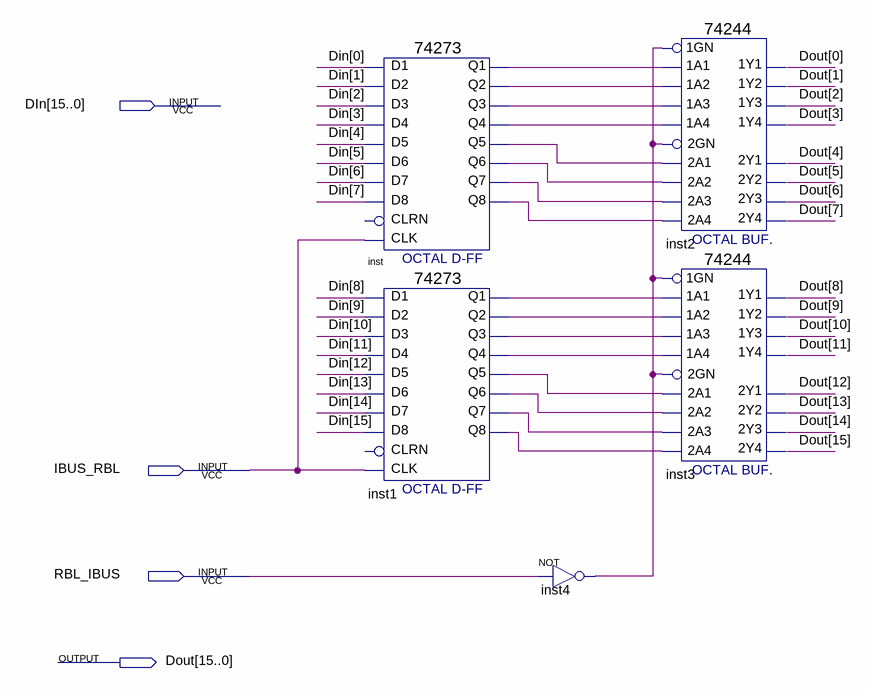
[diagram p0: schematic sheet]
// Quartus schematic RBL.bdf as structural Verilog: 5 symbols, 4 pins
module RBL (
  input  [15:0] DIn,
  input  IBUS_RBL,
  input  RBL_IBUS,
  output [15:0] Dout
);

  wire inst1_q1, inst1_q2, inst1_q3, inst1_q4, inst1_q5, inst1_q6, inst1_q7, inst1_q8, inst4_out, inst_q1,
       inst_q2, inst_q3, inst_q4, inst_q5, inst_q6, inst_q7, inst_q8;

  \74273  inst (
    .D2(DIn[1]), .D3(DIn[2]), .D1(DIn[0]), .D4(DIn[3]), .D7(DIn[6]), .D6(DIn[5]), .D5(DIn[4]), .D8(DIn[7]),
    .CLK(IBUS_RBL), .Q4(inst_q4), .Q1(inst_q1), .Q2(inst_q2), .Q3(inst_q3), .Q6(inst_q6), .Q5(inst_q5),
    .Q7(inst_q7), .Q8(inst_q8));  // open: CLRN
  \74273  inst1 (
    .D2(DIn[9]), .D3(DIn[10]), .D1(DIn[8]), .D4(DIn[11]), .D7(DIn[14]), .D6(DIn[13]), .D5(DIn[12]),
    .D8(DIn[15]), .CLK(IBUS_RBL), .Q4(inst1_q4), .Q1(inst1_q1), .Q2(inst1_q2), .Q3(inst1_q3), .Q6(inst1_q6),
    .Q5(inst1_q5), .Q7(inst1_q7), .Q8(inst1_q8));  // open: CLRN
  not inst4 (inst4_out, RBL_IBUS);
  \74244  inst2 (
    .\1A2 (inst_q2), .\1A4 (inst_q4), .\1A1 (inst_q1), .\1A3 (inst_q3), .\1GN (inst4_out), .\2A3 (inst_q7),
    .\2GN (inst4_out), .\2A1 (inst_q5), .\2A4 (inst_q8), .\2A2 (inst_q6), .\1Y2 (Dout[1]), .\1Y4 (Dout[3]),
    .\2Y1 (Dout[4]), .\1Y1 (Dout[0]), .\2Y3 (Dout[6]), .\2Y4 (Dout[7]), .\1Y3 (Dout[2]), .\2Y2 (Dout[5]));
  \74244  inst3 (
    .\1A2 (inst1_q2), .\1A4 (inst1_q4), .\1A1 (inst1_q1), .\1A3 (inst1_q3), .\1GN (inst4_out),
    .\2A3 (inst1_q7), .\2GN (inst4_out), .\2A1 (inst1_q5), .\2A4 (inst1_q8), .\2A2 (inst1_q6),
    .\1Y2 (Dout[9]), .\1Y4 (Dout[11]), .\2Y1 (Dout[12]), .\1Y1 (Dout[8]), .\2Y3 (Dout[14]), .\2Y4 (Dout[15]),
    .\1Y3 (Dout[10]), .\2Y2 (Dout[13]));
endmodule
